# EAGLE design BlueSMiRF-ChipAnt (EAGLE 9.3.0)
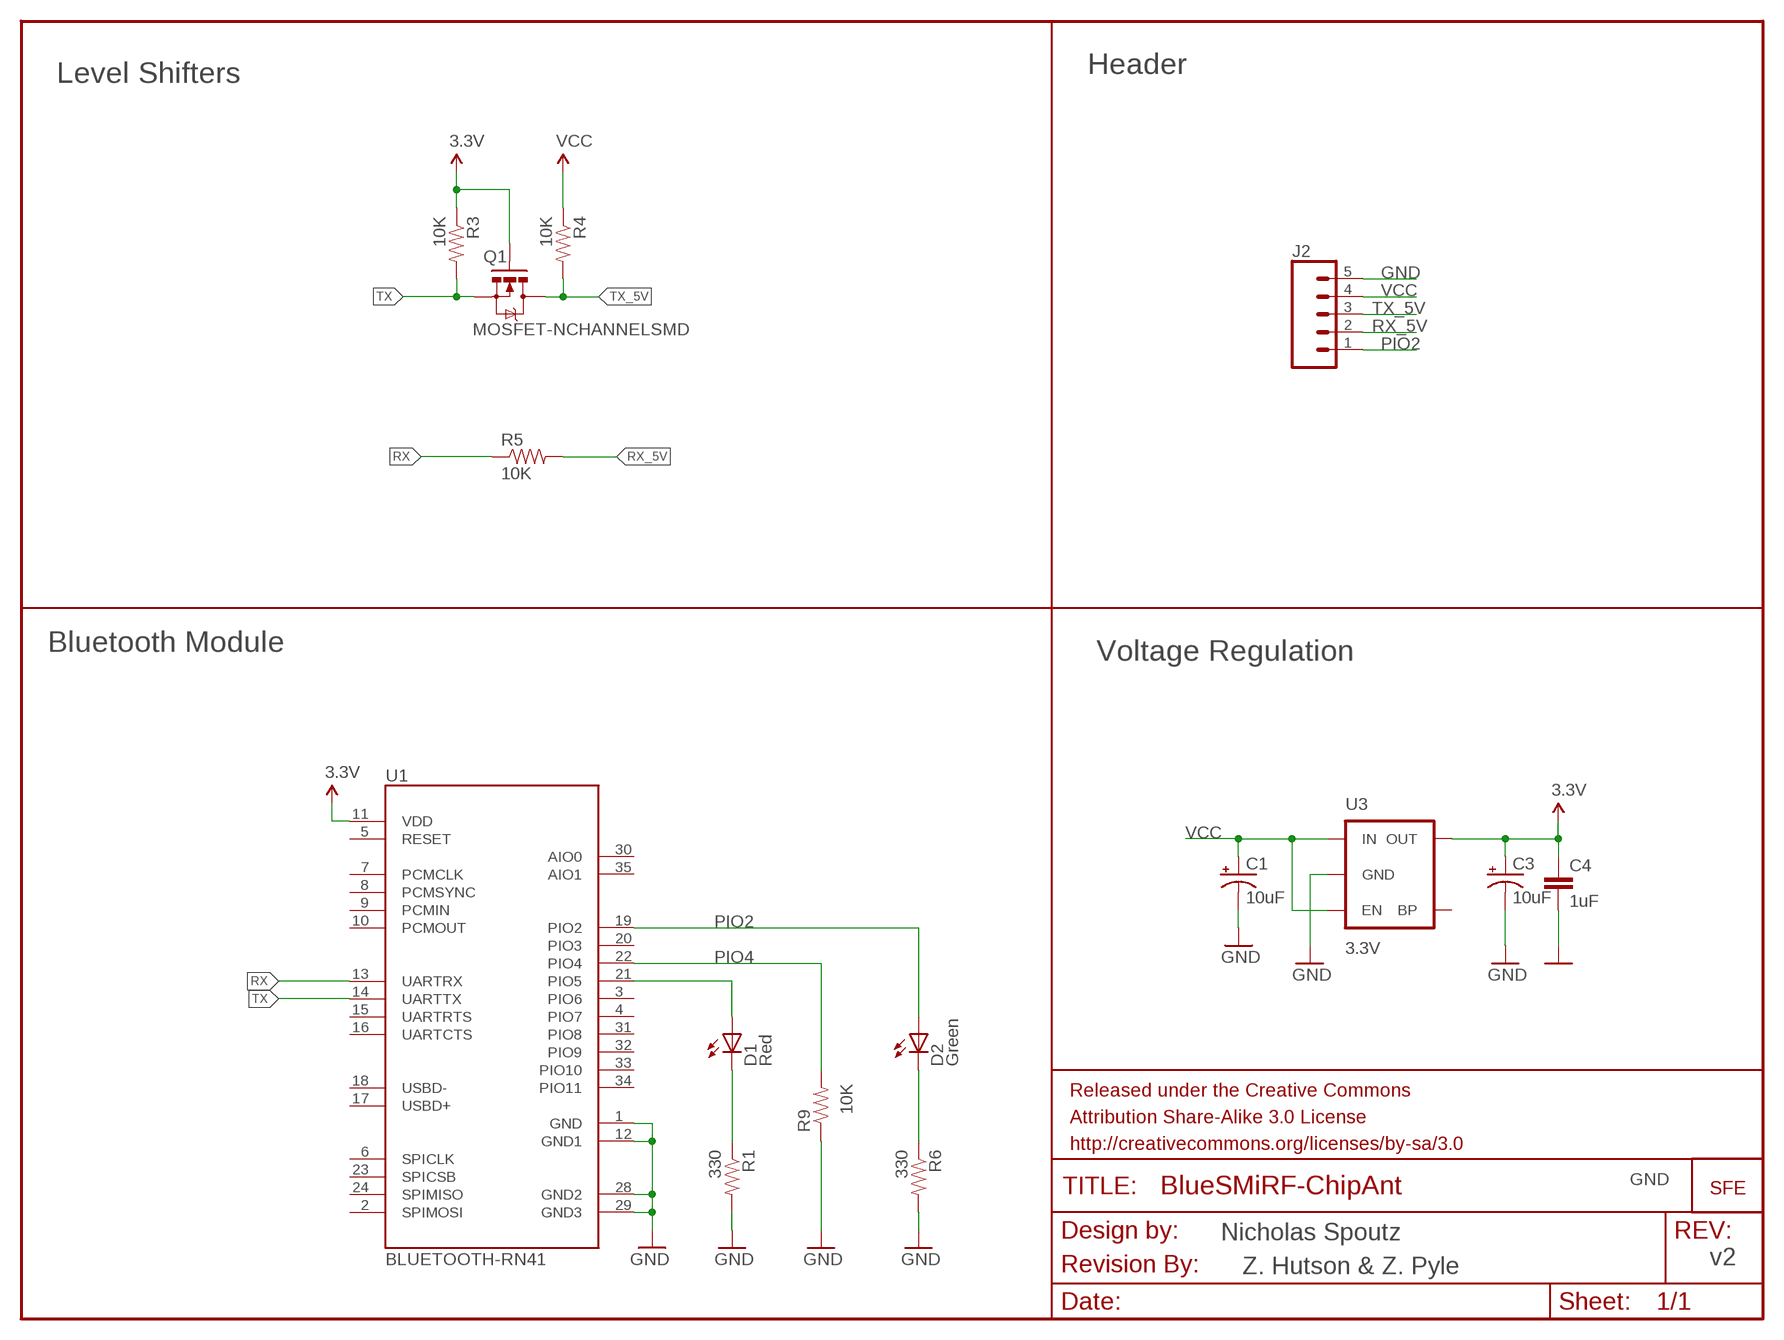
[diagram p0: schematic, sheet 1]

## Parts
C1  10uF  CAP_POL1206  [EIA3216]
C3  10uF  CAP_POL1206  [EIA3216]
C4  1uF  CAP0603-CAP  [0603-CAP]
D1  Red  LED0603  [LED-0603]
D2  Green  LED0603  [LED-0603]
FRAME1  FRAME-LETTER  [CREATIVE_COMMONS]
J2  CONN_05JST  [JST-5-PTH]
Q1  MOSFET-NCHANNELSMD  [SOT23-3]
R1  330  RESISTOR0603-RES  [0603-RES]
R3  10K  RESISTOR0603-RES  [0603-RES]
R4  10K  RESISTOR0603-RES  [0603-RES]
R5  10K  RESISTOR0603-RES  [0603-RES]
R6  330  RESISTOR0603-RES  [0603-RES]
R9  10K  RESISTOR0603-RES  [0603-RES]
U1  BLUETOOTH-RN41  BLUETOOTH-RN41"  [RN41]
U3  3.3V  V_REG_LDOSMD  [SOT23-5]
U$1  LOGO-SFENEW  [SFE-NEW-WEBLOGO]
U$2  REVISION  [REVISION]

## Nets
3.3V: C3.A(+) C4.1 Q1.1(G) R3.1 U1.11(VDD) U3.5(OUT)
D1: D1.C R1.1
D2: D2.C R6.1
GND: C1.C(-) C3.C(-) C4.2 J2.5 R1.2 R6.2 R9.1 U1.1(GND) U1.12(GND1) U1.28(GND2) U1.29(GND3) U3.2(GND)
N$1: D1.A U1.21(PIO5)
PIO2: D2.A J2.1 U1.19(PIO2)
PIO4: R9.2 U1.22(PIO4)
RX: R5.1 U1.13(UARTRX)
RX_5V: J2.2 R5.2
TX: Q1.2(S) R3.2 U1.14(UARTTX)
TX_5V: J2.3 Q1.3(D) R4.2
VCC: C1.A(+) J2.4 R4.1 U3.1(IN) U3.3(EN)
Unconnected: U1.2(SPIMOSI) U1.3(PIO6) U1.4(PIO7) U1.5(RESET) U1.6(SPICLK) U1.7(PCMCLK) U1.8(PCMSYNC) U1.9(PCMIN) U1.10(PCMOUT) U1.15(UARTRTS) U1.16(UARTCTS) U1.17(USBD+) U1.18(USBD-) U1.20(PIO3) U1.23(SPICSB) U1.24(SPIMISO) U1.30(AIO0) U1.31(PIO8) U1.32(PIO9) U1.33(PIO10) U1.34(PIO11) U1.35(AIO1) U3.4(BP)

## Notes on the sheet
- Header
- Level Shifters
- Bluetooth Module
- Voltage Regulation
- Nicholas Spoutz
- v2
- Z. Hutson & Z. Pyle

## Library data of the parts
C1 C3 = SparkFun:CAP_POL: Capacitor Polarized These are standard SMD and PTH capacitors. Normally 10uF, 47uF, and 100uF in electrolytic and tantalum varieties. Always verify the external diameter of the through hole cap, it varies with capacity, voltage, and manufacturer. The EIA devices should be standard.
C4 = SparkFun:CAP: Capacitor Standard 0603 ceramic capacitor, and 0.1" leaded capacitor.
D1 D2 = SparkFun:LED: LEDs Standard schematic elements and footprints for 5mm, 3mm, 1206, and 0603 sized LEDs. 5mm - Spark Fun Electronics SKU : COM-00529 (and others)
FRAME1 = SparkFun-Aesthetics:FRAME-LETTER: Schematic Frame Standard 8.5x11 US Letter frame
J2 = SparkFun-Connectors:CONN_05: Multi connection point. Often used as Generic Header-pin footprint for 0.1 inch spaced/style header connections On any of the 0.1 inch spaced packages, you can populate with these: Break Away Headers - Straight <https://www.sparkfun.com/products/116> (PRT-00116) Break Away Male Headers - Right Angle <https://www.sparkfun.com/products/553> (PRT-00553) Female Headers <https://www.sparkfun.com/products/115> (PRT-00115) Break Away Headers - Machine Pin <https://www.sparkfun.com/products/117> (PRT-00117) Break Away Female Headers - Swiss Machine Pin <https://www.sparkfun.com/products/743> (PRT-00743) For SCREWTERMINALS and SPRING TERMINALS visit here: Screw Terimnals on SparkFun.com <https://www.sparkfun.com/search/results?term=Screw+Terminals> (5mm/3.5mm/2.54mm spacing) This device is also useful as a general connection point to wire up your design to another part of your project. Our various solder wires solder well into these plated through hole pads. Hook-Up Wire - Assortment (Stranded, 22 AWG) <https://www.sparkfun.com/products/11375> (PRT-11375) Hook-Up Wire - Assortment (Solid Core, 22 AWG) <https://www.sparkfun.com/products/11367> (PRT-11367) View the entire wire category on our website here <https://www.sparkfun.com/categories/141> Special notes: Molex polarized connector foot print use with SKU : PRT-08231 with associated crimp pins and housings. 1MM SMD Version SKU: PRT-10208; SF_ID: PRT-09917
Q1 = SparkFun:MOSFET-NCHANNEL
R1 R3-R6 R9 = SparkFun:RESISTOR: Resistor Basic schematic elements and footprints for 0603, 1206, and PTH resistors.
U1 = SparkFun-RF:BLUETOOTH-RN41: Bluetooth SMD module
U3 = SparkFun:V_REG_LDO: Voltage Regulator LDO Standard 150mA LDO voltage regulator in SOT-23 layout. Micrel part MIC5205. BP (by-pass) pin is used to lower output noise with 470pF cap.
U$1 = SparkFun:LOGO-SFE: Spark Fun Electronics PCB Logo This is the standard Spark Fun Electronics PCB logo.
U$2 = SparkFun-Aesthetics:REVISION

## Board
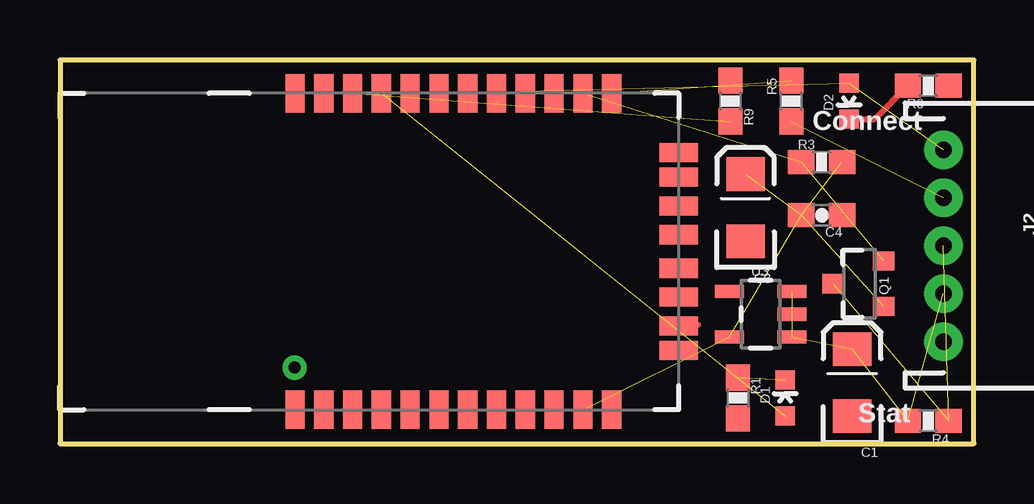
[diagram p1: board, top side]
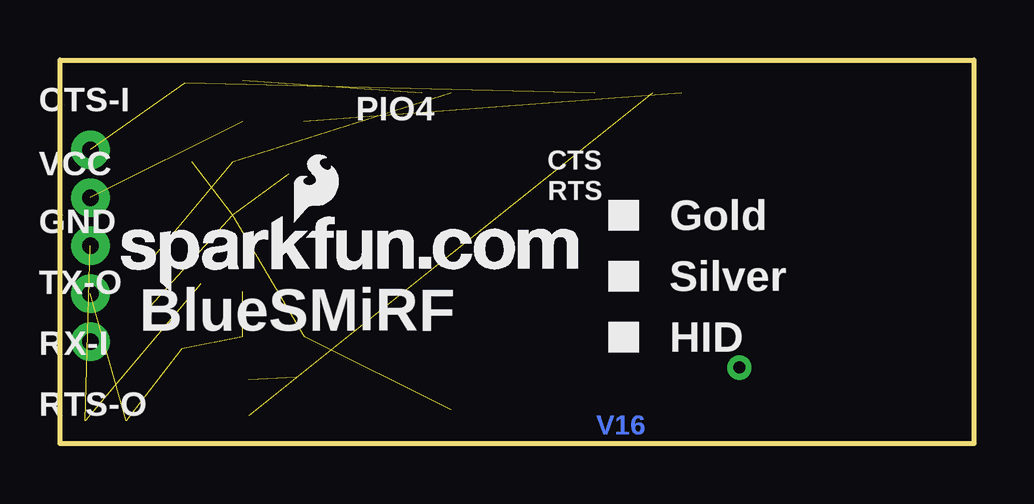
[diagram p2: board, bottom side, seen from below]

Size 38.1 x 16 mm. Coordinates in mm from the lower left corner, seen from the top.
Outline: 0,0 38.1,0 38.1,16 0,16 0,0
Copper layers (1*16): Top 0.035mm / dielectric 1.5mm / Bottom 0.035mm
Design rules "SparkFun-2-layer-STANDARD": minimum track width 10mil, minimum drill 20mil, track to track 10mil, track to pad 8mil, pad to pad 8mil, via to via 10mil, smd to smd 8mil, copper to edge 8mil, drill to drill 8mil, minimum pad ring 10mil, minimum via ring 10mil, stop-mask expansion 4mil, vias tented up to drill 25mil, thermal gap 10mil

### Footprints (pad centres in the part's own frame; a part is rotated, then mirrored left to right if it is on the bottom)
EIA3216 = smd 1.4 x 1.6: A 1.4,0; C -1.4,0
0603-CAP = smd 1.1 x 1: 1 -0.85,0; 2 0.85,0
LED-0603 = smd 0.8 x 0.8: A 0,-0.75; C 0,0.75
JST-5-PTH = drill 0.7 pad 1.6: 1 -4,0; 2 -2,0; 3 0,0; 4 2,0; 5 4,0
SOT23-3 = smd 0.8 x 0.9: 1 -0.95,-1; 2 0.95,-1; 3 0,1.1
0603-RES = smd 1.1 x 1: 1 -0.85,0; 2 0.85,0
RN41 = smd 0.8 x 1.6: 1 -6.6,-6.6; 2 -5.4,-6.6; 3 -4.2,-6.6; 4 -3,-6.6; 5 -1.8,-6.6; 6 -0.6,-6.6; 7 0.6,-6.6; 8 1.8,-6.6; 9 3,-6.6; 10 4.2,-6.6; 11 5.4,-6.6; 12 6.6,-6.6; 13 6.6,6.6; 14 5.4,6.6; 15 4.2,6.6; 16 3,6.6; 17 1.8,6.6; 18 0.6,6.6; 19 -0.6,6.6; 20 -1.8,6.6; 21 -3,6.6; 22 -4.2,6.6; 23 -5.4,6.6; 24 -6.6,6.6 | smd 1.6 x 0.8: 28 9.4,3.1; 29 9.4,-3.1; 30 9.4,4.122; 31 9.4,1.9; 32 9.4,0.7; 33 9.4,-0.7; 34 9.4,-1.9; 35 9.4,-4.122
SOT23-5 = smd 0.55 x 1.2: 1 -0.95,-1.3; 2 0,-1.3; 3 0.95,-1.3; 4 0.95,1.3; 5 -0.95,1.3

### Placement (x,y rotation side)
C1  33.02,2.54 90 top
C3  28.57,9.84 90 top
C4  31.75,9.53 0 top
D1  30.23,1.91 0 top
D2  32.89,14.29 180 top
FRAME1  3.07,-8.89 0 top  (outside the outline)
J2  36.83,8.26 270 top
Q1  33.34,6.67 90 top
R1  28.26,1.91 270 top
R3  31.75,11.75 180 top
R4  36.2,0.95 0 top
R5  30.48,14.29 270 top
R6  36.2,14.92 0 top
R9  27.94,14.29 270 top
U1  16.4,8.01 0 top
U3  29.21,5.4 90 top
U$1  35.56,6.35 0 bottom
U$2  14.61,-11.43 0 top  (outside the outline)

### Tracks (layer width: path | path; a pad name or v marks a point on that pad's centre or on a via)
3.3V  (5 unrouted)
D1  (1 unrouted)
D2
  Top 0.254: D2.C 33.96,13.54 R6.1
GND  (via drill 0.51)
  Top 0.254: U1.29 25.84,4.95 26.59,4.95
  other vias: 9.78,3.17
N$1  (1 unrouted)
  Top 0.254: U1.21
PIO2  (2 unrouted)
PIO4  (1 unrouted)
  Top 0.254: U1.22
RX  (1 unrouted)
RX_5V  (1 unrouted)
TX  (2 unrouted)
TX_5V  (2 unrouted)
VCC  (4 unrouted)

### Text on the board
Bottom: V16
tPlace: Connect | Stat
bPlace: CTS-I | PIO4 | CTS | VCC | RTS | Gold | GND | Silver | TX-O | BlueSMiRF | HID | RX-I | RTS-O
Document: J. Lindblom | T. Klopfenstein